# EAGLE schematic schematic (EAGLE 9.3.0)
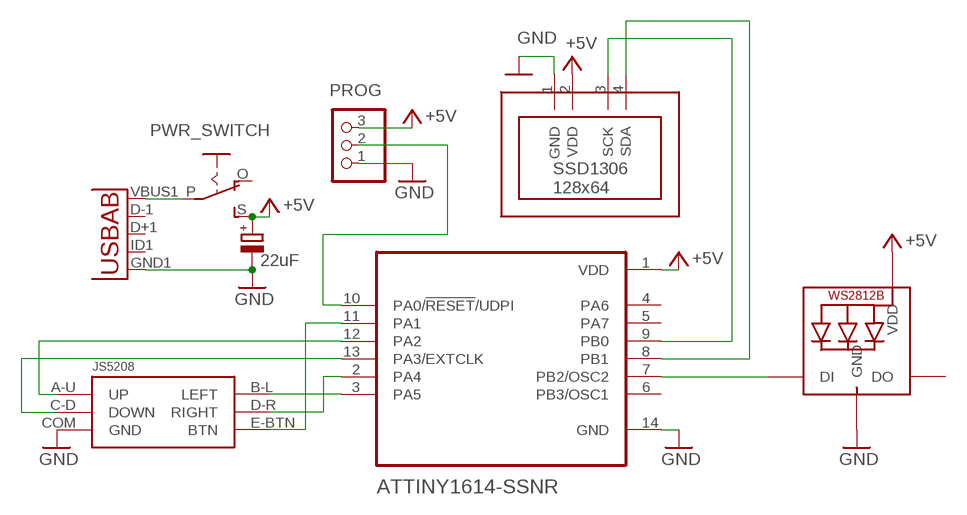
[diagram p0: schematic, sheet 1]

## Parts
C2  22uF  CPOL-EUE2-4  [E2-4]
LED1  WS2812B5050  [WS2812B]
PROG  PINHD-1X3  [1X03]
PWR_SWITCH  EG1218S  [EG1218]
U1  ATTINY1614-SSNR  [SOIC127P600X175-14N]
U2  USB-THROUGH  [USB-MICRO-THROUGH]
U$1  JS5208  [JS5208_PKG]
U$2  SSD1306_128X64_OLEDPINHEAD  [1X04-CLEANBIG]

## Nets
+5V: C2.+ LED1.1-VDD(VDD) PROG.3 PWR_SWITCH.S U1.1(VDD) U$2.2(VDD)
GND: C2.- LED1.3-GND(GND) PROG.1 U1.14(GND) U2.GND1(GND) U$1.COM(GND) U$2.1(GND)
N$1: PWR_SWITCH.P U2.VBUS1(VBUS)
N$2: PROG.2 U1.10(PA0/!RESET!/UDPI)
N$3: U1.11(PA1) U$1.E-BTN(BTN)
N$4: U1.2(PA4) U$1.D-R(RIGHT)
N$5: U1.3(PA5) U$1.B-L(LEFT)
N$6: U1.12(PA2) U$1.A-U(UP)
N$7: U1.13(PA3/EXTCLK) U$1.C-D(DOWN)
N$8: LED1.4-DIN(DI) U1.7(PB2/OSC2)
N$9: U1.8(PB1) U$2.4(SDA)
N$10: U1.9(PB0) U$2.3(SCK)
Unconnected: LED1.2-DOUT(DO) PWR_SWITCH.O U1.4(PA6) U1.5(PA7) U1.6(PB3/OSC1) U2.D+1(D+) U2.D-1(D-) U2.ID1(USBID)

## Library data of the parts
C2 = rcl:CPOL-EU: POLARIZED CAPACITOR, European symbol; SPICEPREFIX: C
LED1 = adafruit:WS2812B
PROG = adafruit:PINHD-1X3: PIN HEADER
PWR_SWITCH = EG1218:EG1218: SLIDING SWITCH 0.1" spacing through hole, vertical SPDT slide switch http://www.ladyada.net/library/pcb/eaglelibrary.html; AVAILABILITY: Unavailable; DESCRIPTION: EG Series SPDT On-On Vertical Through Hole Slide Switch; MF: E-Switch; MP: EG1218; PACKAGE: FakePackage u; PRICE: None
U1 = ATTINY1614-SSNR:ATTINY1614-SSNR: 20MHz, SOIC, 85C, Green, 14 SOIC .150in T/R; AVAILABILITY: Unavailable; DESCRIPTION: 20MHz, SOIC, 85C, Green, 14 SOIC .150in T/R; MF: Microchip; MP: ATTINY1614-SSNR; PACKAGE: SO-14 Microchip; PRICE: None
U2 = MicroUSB:USB: This is a USB AB connector that is compatible with USB OTG. i.e. this connector can serve as a host or device
U$1 = JS5208:JS5208; AVAILABILITY: Unavailable; DESCRIPTION: JS Series 20 mA Gull Wing Silver Contact Navigation Switch; MF: E-Switch; MP: JS5208; PACKAGE: None; PRICE: None
U$2 = SSD1306_OLED:SSD1306_128X64_OLED